# EAGLE design SparkFun_ICD-ICD2 (EAGLE 7.2.0)
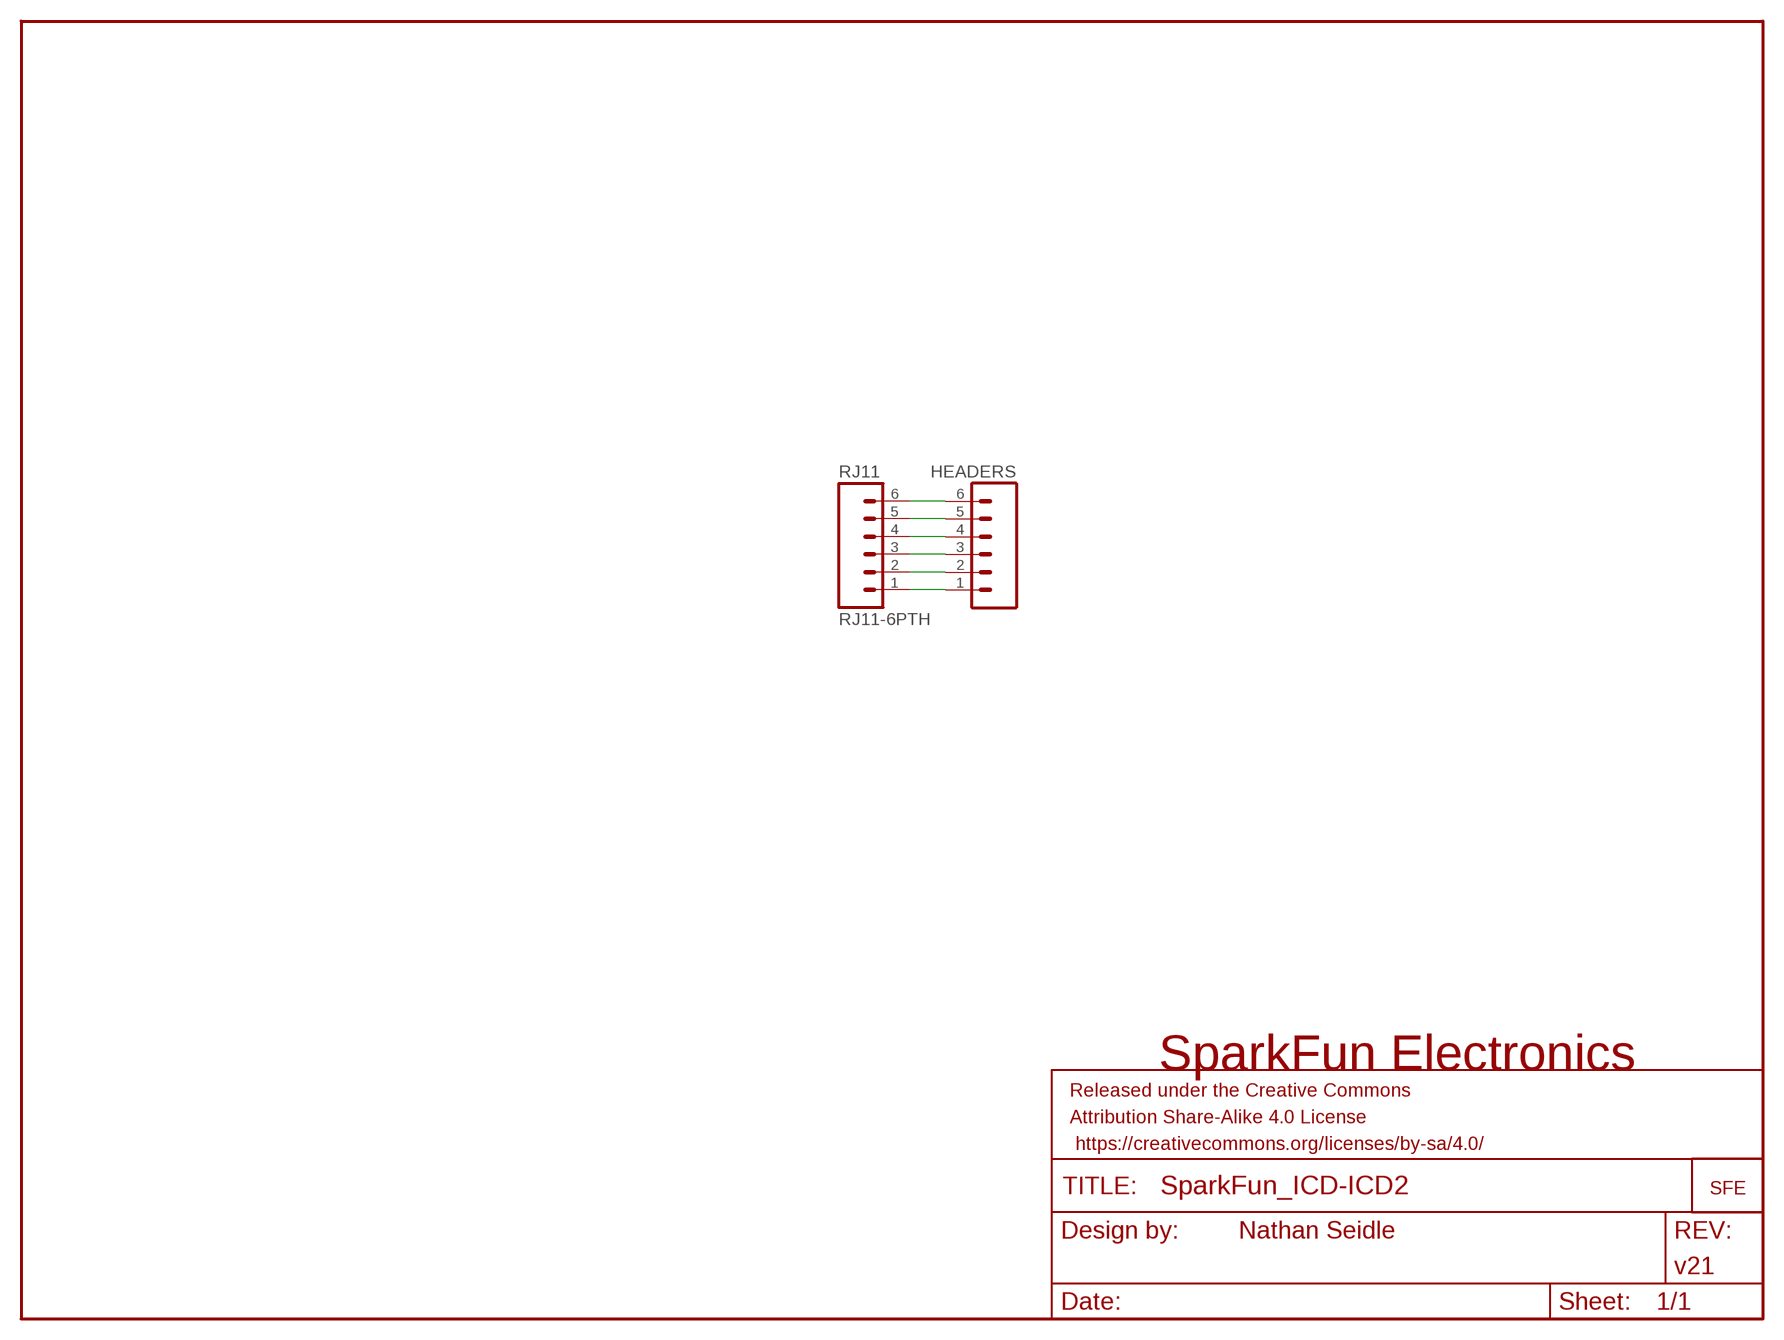
[diagram p0: schematic, sheet 1]

## Parts
FRAME1  FRAME-LETTERNO_PACKAGE  [DUMMY]
HEADERS  M06POLAR  [MOLEX-1X6]
JP1  LOGO-SFESK  [SFE-LOGO-FLAME]
RJ11  RJ11-6PTH  [RJ11-6]

## Nets
N$1: HEADERS.6 RJ11.6
N$2: HEADERS.1 RJ11.1
N$3: HEADERS.2 RJ11.2
N$4: HEADERS.3 RJ11.3
N$5: HEADERS.4 RJ11.4
N$6: HEADERS.5 RJ11.5

## Notes on the sheet
- SparkFun Electronics

## Library data of the parts
FRAME1 = SparkFun-Aesthetics:FRAME-LETTER: Schematic Frame Standard 8.5x11 US Letter frame; DESIGNER: Nathan Seidle; VERSION: v21
HEADERS = SparkFun:M06: Header 6 Standard 6-pin 0.1" header. Use with straight break away headers (SKU : PRT-00116), right angle break away headers (PRT-00553), swiss pins (PRT-00743), machine pins (PRT-00117), and female headers (PRT-00115). Molex polarized connector foot print use with SKU : PRT-08094 with associated crimp pins and housings. NOTES ON THE VARIANTS LOCK and LOCK_LONGPADS... This footprint was designed to help hold the alignment of a through-hole component (i.e. 6-pin header) while soldering it into place. You may notice that each hole has been shifted either up or down by 0.005 of an inch from it's more standard position (which is a perfectly straight line). This slight alteration caused the pins (the squares in the middle) to touch the edges of the holes. Because they are alternating, it causes a "brace" to hold the component in place. 0.005 has proven to be the perfect amount of "off-center" position when using our standard breakaway headers. Although looks a little odd when you look at the bare footprint, once you have a header in there, the alteration is very hard to notice. Also, if you push a header all the way into place, it is covered up entirely on the bottom side. This idea of altering the position of holes to aid alignment will be further integrated into the Sparkfun Library for other footprints. It can help hold any component with 3 or more connection pins.
JP1 = SparkFun:LOGO-SFE: Spark Fun Electronics PCB Logo This is the standard Spark Fun Electronics PCB logo.
RJ11 = SparkFun:RJ11-6: RJ11 Jack Simple 6 pin RJ11 jack. Commonly found on CAT3 devices and Microchip programmers. SKU: PRT-00132

## Board
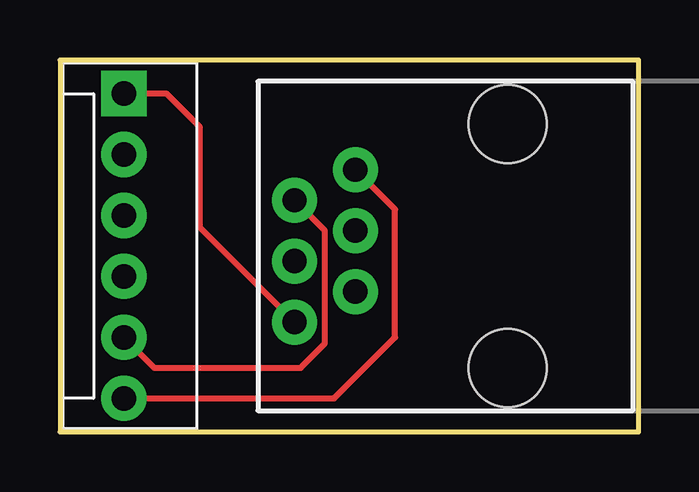
[diagram p1: board, top side]
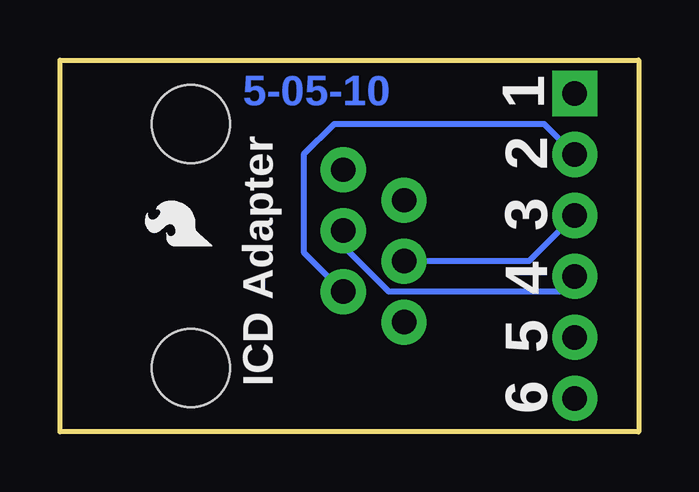
[diagram p2: board, bottom side, seen from below]

Size 24.13 x 15.49 mm. Coordinates in mm from the lower left corner, seen from the top.
Outline: 0,15.49 0,0 24.13,0 24.13,15.49 0,15.49
Copper layers (1*16): Top 0.035mm / dielectric 1.5mm / Bottom 0.035mm
Design rules "SparkFun": minimum track width 8mil, minimum drill 20mil, track to track 8mil, track to pad 8mil, pad to pad 8mil, via to via 8mil, smd to smd 8mil, copper to edge 9mil, drill to drill 8mil, minimum pad ring 12mil, minimum via ring 10mil, stop-mask expansion 4mil, vias tented up to drill 20mil, thermal gap 10mil

### Footprints (pad centres in the part's own frame; a part is rotated, then mirrored left to right if it is on the bottom)
MOLEX-1X6 = drill 1.016 pad 1.88 square: 1 0,0 | drill 1.016 pad 1.88: 2 2.54,0; 3 5.08,0; 4 7.62,0; 5 10.16,0; 6 12.7,0
RJ11-6 = drill 1.016 pad 1.88: 1 1.905,8.89; 2 3.175,6.35; 3 4.445,8.89; 4 5.715,6.35; 5 6.985,8.89; 6 8.255,6.35 | hole 3.251: 0,0; 10.16,0

### Placement (x,y rotation side)
FRAME1  -0.1,0.13 0 top
HEADERS  2.67,14.1 270 top
JP1  17.78,7.75 90 bottom
RJ11  18.67,2.67 90 top

### Tracks (layer width: path | path; a pad name or v marks a point on that pad's centre or on a via)
N$1
  Top 0.254: RJ11.6 13.97,9.27 13.97,3.94 11.43,1.4 HEADERS.6
N$2
  Top 0.254: HEADERS.1 4.45,14.1 5.84,12.7 5.84,8.51 RJ11.1
N$3
  Bottom 0.254: RJ11.2 13.97,7.49 13.97,11.56 12.7,12.83 3.94,12.83 HEADERS.2
N$4
  Bottom 0.254: HEADERS.3 4.57,7.11 RJ11.3
N$5
  Bottom 0.254: RJ11.4 12.32,7.75 10.41,5.84 3.3,5.84 HEADERS.4
N$6
  Top 0.254: RJ11.5 11.05,8.38 11.05,3.68 10.03,2.67 3.94,2.67 HEADERS.5

### Text on the board
Bottom: 5-05-10
bPlace: 1 | 2 | 3 | 4 | 5 | ICD Adapter | 6